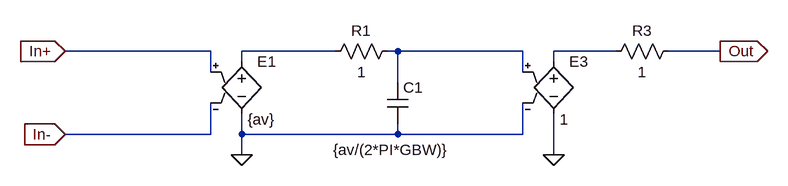
[diagram p0: schematic ao_1pole.asc]
ao_1pole.asc, the LTspice schematic file:
Version 4
SHEET 1 1188 680
WIRE 80 96 -144 96
WIRE 272 96 128 96
WIRE 368 96 352 96
WIRE 560 96 368 96
WIRE 704 96 608 96
WIRE 864 96 784 96
WIRE 128 112 128 96
WIRE 608 112 608 96
WIRE 80 128 80 96
WIRE 560 128 560 96
WIRE 368 144 368 96
WIRE 80 224 80 176
WIRE 80 224 -144 224
WIRE 128 224 128 192
WIRE 368 224 368 208
WIRE 368 224 128 224
WIRE 560 224 560 176
WIRE 560 224 368 224
WIRE 128 256 128 224
WIRE 608 256 608 192
FLAG 128 256 0
FLAG -144 96 In+
IOPIN -144 96 In
FLAG 864 96 Out
IOPIN 864 96 Out
FLAG -144 224 In-
IOPIN -144 224 In
FLAG 608 256 0
SYMBOL e 128 96 R0
WINDOW 3 9 105 Left 2
SYMATTR Value {av}
SYMATTR InstName E1
SYMBOL res 368 80 R90
WINDOW 0 0 56 VBottom 2
WINDOW 3 32 56 VTop 2
SYMATTR InstName R1
SYMATTR Value 1
SYMBOL e 608 96 R0
WINDOW 3 9 105 Left 2
SYMATTR Value 1
SYMATTR InstName E3
SYMBOL res 800 80 R90
WINDOW 0 0 56 VBottom 2
WINDOW 3 32 56 VTop 2
SYMATTR InstName R3
SYMATTR Value 1
SYMBOL cap 352 144 R0
WINDOW 3 -83 104 Left 2
SYMATTR Value {av/(2*PI*GBW)}
SYMATTR InstName C1

The netlist it stands for:
* ao_1pole.asc
E1 N001 0 In+ In- {av}
R1 N002 N001 1
E3 N003 0 N002 0 1
R3 Out N003 1
C1 N002 0 {av/(2*PI*GBW)}
.backanno
.end